# Altium schematic sheet Sheet1_2518_MEZ.SchDoc
size A4; SheetNumber: 1; SheetTotal: 1
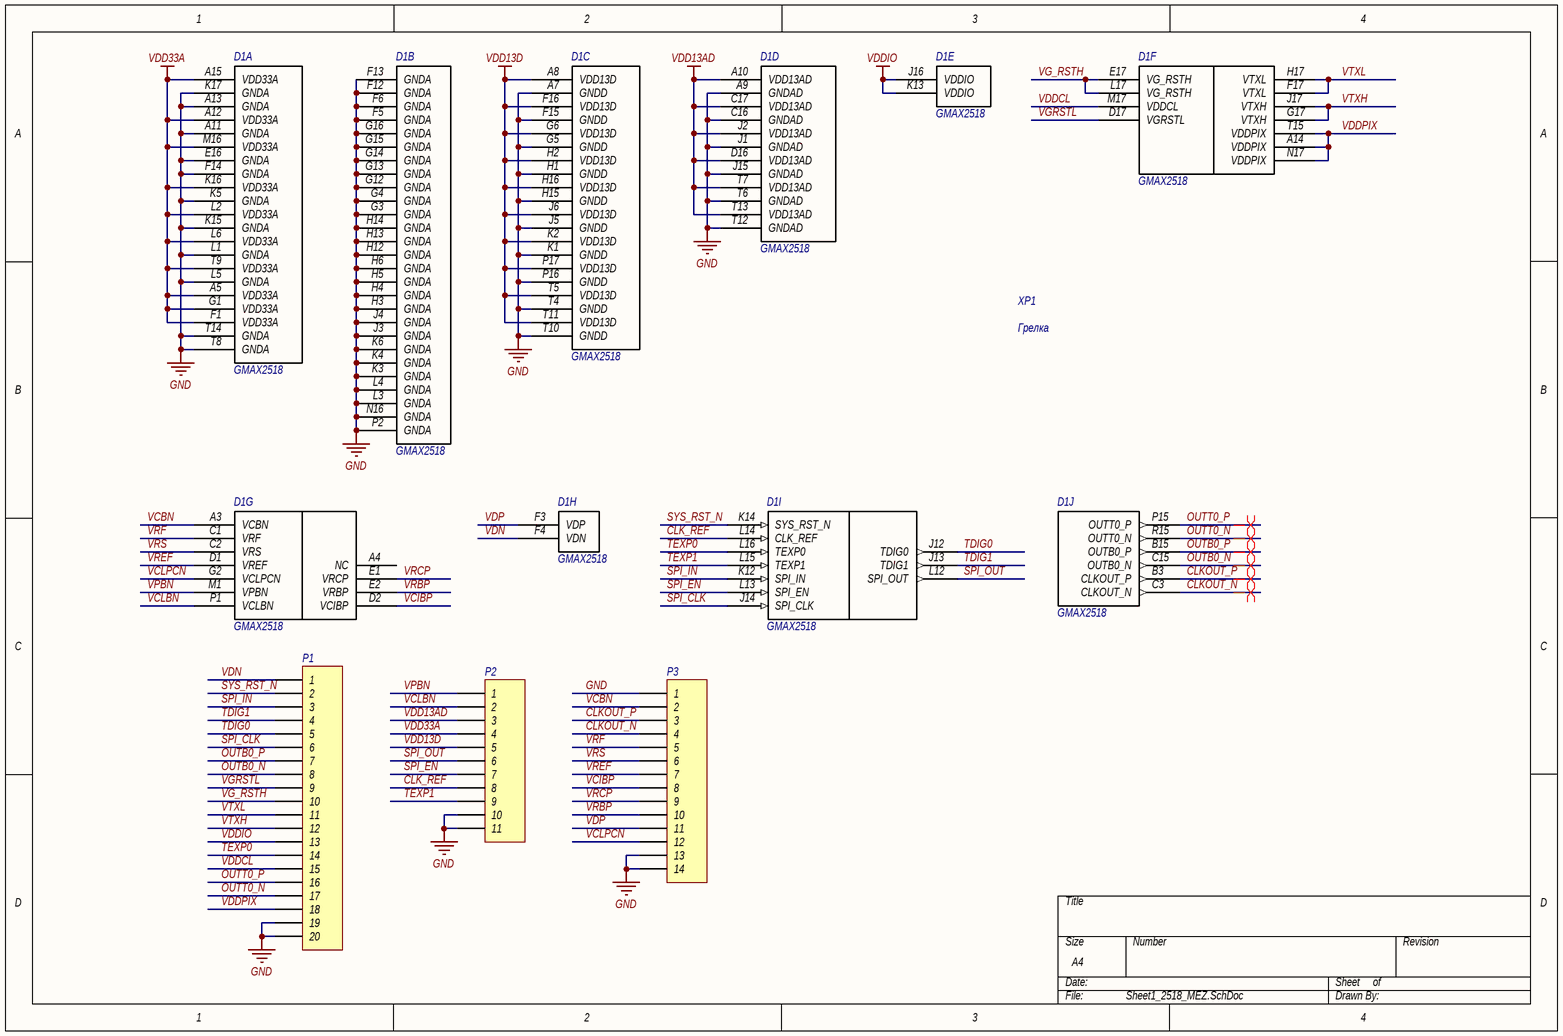
[diagram p0: Sheet1_2518_MEZ.SchDoc]

## Parts
D1  GMAX2518  [GMAX2518]  (parts A,B,C,D,E,F,G,H,I,J of 10)
P1  Header 20  [HDR1X20]  (value not drawn)
P2  Header 11  [HDR1X11]  (value not drawn)
P3  Header 14  [HDR1X14]  (value not drawn)
XP1  Грелка  [Грелка]

## Nets
GND: D1.A7(GNDD) D1.A9(GNDAD) D1.A11(GNDA) D1.A13(GNDA) D1.C16(GNDAD) D1.E16(GNDA) D1.F5(GNDA) D1.F6(GNDA) D1.F12(GNDA) D1.F13(GNDA) D1.F14(GNDA) D1.F15(GNDD) D1.G3(GNDA) D1.G4(GNDA) D1.G5(GNDD) D1.G12(GNDA) D1.G13(GNDA) D1.G14(GNDA) D1.G15(GNDA) D1.G16(GNDA) D1.H1(GNDD) D1.H3(GNDA) D1.H4(GNDA) D1.H5(GNDA) D1.H6(GNDA) D1.H12(GNDA) D1.H13(GNDA) D1.H14(GNDA) D1.H15(GNDD) D1.J1(GNDAD) D1.J3(GNDA) D1.J4(GNDA) D1.J5(GNDD) D1.J15(GNDAD) D1.K1(GNDD) D1.K3(GNDA) D1.K4(GNDA) D1.K5(GNDA) D1.K6(GNDA) D1.K15(GNDA) D1.K17(GNDA) D1.L1(GNDA) D1.L3(GNDA) D1.L4(GNDA) D1.L5(GNDA) D1.N16(GNDA) D1.P2(GNDA) D1.P16(GNDD) D1.T4(GNDD) D1.T6(GNDAD) D1.T8(GNDA) D1.T10(GNDD) D1.T12(GNDAD) D1.T14(GNDA) P1.19 P1.20 P2.10 P2.11 P3.1 P3.13 P3.14
VDD13AD: D1.A10(VDD13AD) D1.C17(VDD13AD) D1.D16(VDD13AD) D1.J2(VDD13AD) D1.T7(VDD13AD) D1.T13(VDD13AD) P2.3
VDD13D: D1.A8(VDD13D) D1.F16(VDD13D) D1.G6(VDD13D) D1.H2(VDD13D) D1.H16(VDD13D) D1.J6(VDD13D) D1.K2(VDD13D) D1.P17(VDD13D) D1.T5(VDD13D) D1.T11(VDD13D) P2.5
VDD33A: D1.A5(VDD33A) D1.A12(VDD33A) D1.A15(VDD33A) D1.F1(VDD33A) D1.G1(VDD33A) D1.K16(VDD33A) D1.L2(VDD33A) D1.L6(VDD33A) D1.M16(VDD33A) D1.T9(VDD33A) P2.4
VDDIO: D1.J16(VDDIO) D1.K13(VDDIO) P1.13
CLK_REF: D1.L14(CLK_REF) P2.8
CLKOUT_N: D1.C3(CLKOUT_N) P3.4
CLKOUT_P: D1.B3(CLKOUT_P) P3.3
OUTB0_N: D1.C15(OUTB0_N) P1.8
OUTB0_P: D1.B15(OUTB0_P) P1.7
OUTT0_N: D1.R15(OUTT0_N) P1.17
OUTT0_P: D1.P15(OUTT0_P) P1.16
SPI_CLK: D1.J14(SPI_CLK) P1.6
SPI_EN: D1.L13(SPI_EN) P2.7
SPI_IN: D1.K12(SPI_IN) P1.3
SPI_OUT: D1.L12(SPI_OUT) P2.6
SYS_RST_N: D1.K14(SYS_RST_N) P1.2
TDIG0: D1.J12(TDIG0) P1.5
TDIG1: D1.J13(TDIG1) P1.4
TEXP0: D1.L16(TEXP0) P1.14
TEXP1: D1.L15(TEXP1) P2.9
VCBN: D1.A3(VCBN) P3.2
VCIBP: D1.D2(VCIBP) P3.8
VCLBN: D1.P1(VCLBN) P2.2
VCLPCN: D1.G2(VCLPCN) P3.12
VDDCL: D1.M17(VDDCL) P1.15
VDDPIX: D1.A14(VDDPIX) D1.N17(VDDPIX) D1.T15(VDDPIX) P1.18
VDN: D1.F4(VDN) P1.1
VDP: D1.F3(VDP) P3.11
VG_RSTH: D1.E17(VG_RSTH) D1.L17(VG_RSTH) P1.10
VGRSTL: D1.D17(VGRSTL) P1.9
VPBN: D1.M1(VPBN) P2.1
VRBP: D1.E2(VRBP) P3.10
VRCP: D1.E1(VRCP) P3.9
VREF: D1.D1(VREF) P3.7
VRF: D1.C1(VRF) P3.5
VRS: D1.C2(VRS) P3.6
VTXH: D1.G17(VTXH) D1.J17(VTXH) P1.12
VTXL: D1.F17(VTXL) D1.H17(VTXL) P1.11

Not connected (* = marked no-connect by the designer): D1 A4(NC)

## Layout directives
differential pair: CLKOUT_N, CLKOUT_P, OUTB0_N, OUTB0_P, OUTT0_N, OUTT0_P

## Library data of the parts
P1 = Header 20: Header, 20-Pin; LatestRevisionDate: 17-Jul-2002; LatestRevisionNote: Re-released for DXP Platform.; Publisher: Altium Limited
P2 = Header 11: Header, 11-Pin; LatestRevisionDate: 17-Jul-2002; LatestRevisionNote: Re-released for DXP Platform.; Publisher: Altium Limited
P3 = Header 14: Header, 14-Pin; LatestRevisionDate: 17-Jul-2002; LatestRevisionNote: Re-released for DXP Platform.; Publisher: Altium Limited